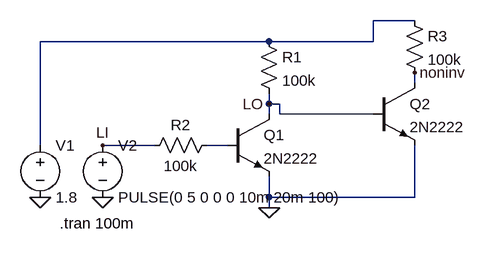
[diagram p0: schematic Unidirectional_lvlshift.asc]
Unidirectional_lvlshift.asc, the LTspice schematic file:
Version 4
SHEET 1 880 680
WIRE 464 -32 400 -32
WIRE 240 0 -112 0
WIRE 400 0 400 -32
WIRE 400 0 240 0
WIRE 464 64 464 48
WIRE 240 96 240 80
WIRE 256 96 240 96
WIRE 240 112 240 96
WIRE 256 112 256 96
WIRE 400 112 256 112
WIRE -112 160 -112 0
WIRE 64 160 -16 160
WIRE 176 160 144 160
WIRE 240 240 240 208
WIRE 464 240 464 160
WIRE 464 240 240 240
WIRE 240 256 240 240
FLAG 240 256 0
FLAG -112 240 0
FLAG -16 240 0
FLAG 240 96 LO
FLAG -16 160 LI
FLAG 464 48 noninv
SYMBOL npn 176 112 R0
SYMATTR InstName Q1
SYMATTR Value 2N2222
SYMBOL res 224 -16 R0
SYMATTR InstName R1
SYMATTR Value 100k
SYMBOL voltage -112 144 R0
WINDOW 123 0 0 Left 2
WINDOW 39 0 0 Left 2
SYMATTR InstName V1
SYMATTR Value 1.8
SYMBOL voltage -16 144 R0
WINDOW 123 0 0 Left 2
WINDOW 39 0 0 Left 2
SYMATTR InstName V2
SYMATTR Value PULSE(0 5 0 0 0 10m 20m 100)
SYMBOL res 160 144 R90
WINDOW 0 0 56 VBottom 2
WINDOW 3 32 56 VTop 2
SYMATTR InstName R2
SYMATTR Value 100k
SYMBOL res 448 -48 R0
SYMATTR InstName R3
SYMATTR Value 100k
SYMBOL npn 400 64 R0
SYMATTR InstName Q2
SYMATTR Value 2N2222
TEXT -82 280 Left 2 !.tran 100m

The netlist it stands for:
* Unidirectional_lvlshift.asc
Q1 LO N002 0 0 2N2222
R1 N001 LO 100k
V1 N001 0 1.8
V2 LI 0 PULSE(0 5 0 0 0 10m 20m 100)
R2 N002 LI 100k
R3 N001 noninv 100k
Q2 noninv LO 0 0 2N2222
.model NPN NPN
.model PNP PNP
.lib standard.bjt
.tran 100m
.backanno
.end